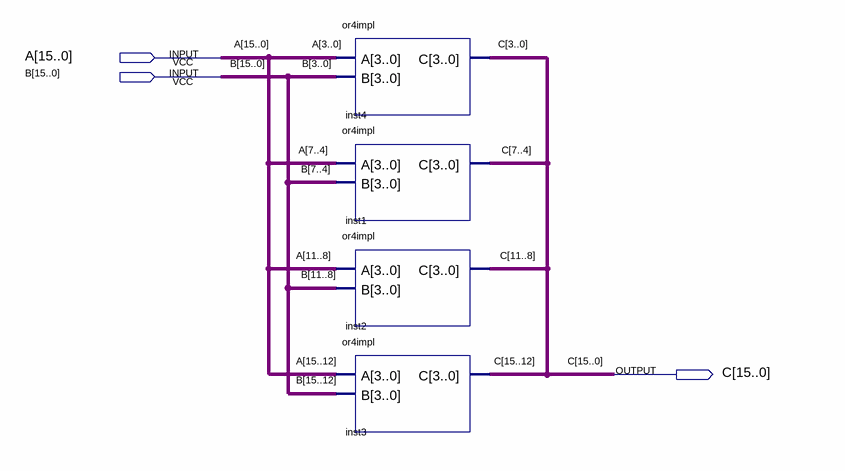
[diagram p0: schematic sheet]
// Quartus schematic or16impl.bdf as structural Verilog: 4 symbols, 3 pins
module or16impl (
  input  [15:0] A,
  input  [15:0] B,
  output [15:0] C
);

  or4impl inst4 (.A(A[3:0]), .B(B[3:0]), .C(C[3:0]));
  or4impl inst1 (.A(A[7:4]), .B(B[7:4]), .C(C[7:4]));
  or4impl inst2 (.A(A[11:8]), .B(B[11:8]), .C(C[11:8]));
  or4impl inst3 (.A(A[15:12]), .B(B[15:12]), .C(C[15:12]));
endmodule
